# Altium schematic sheet pay_ssm.SchDoc
size A4
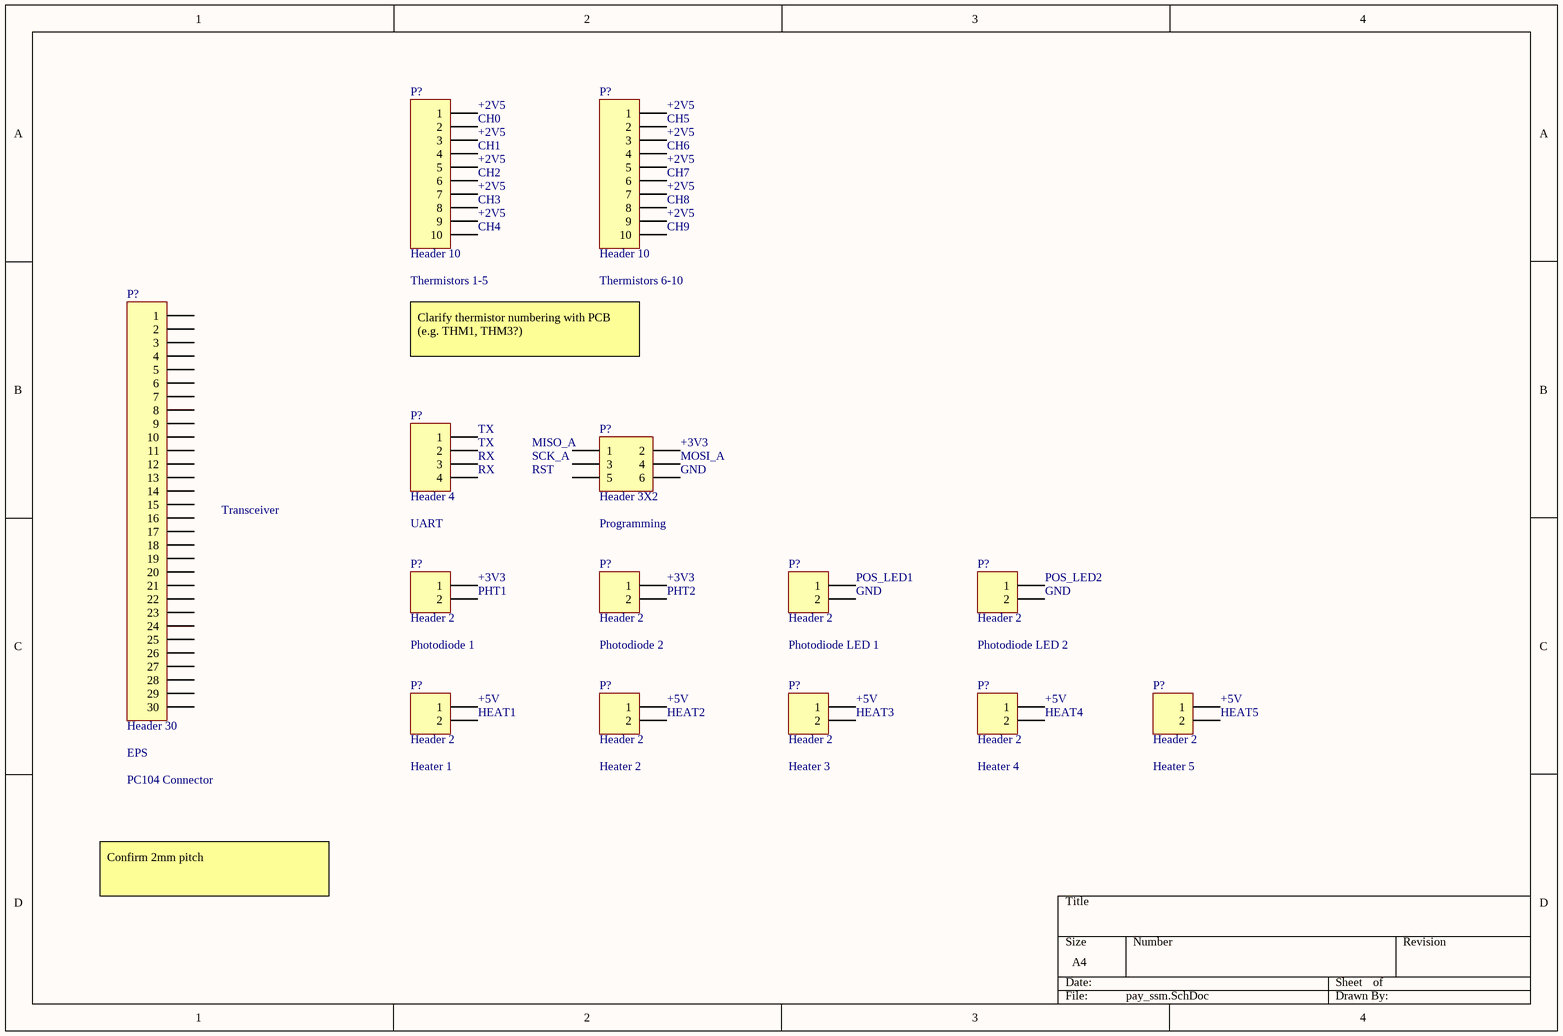
[diagram p0: pay_ssm.SchDoc]

## Parts
(Parts that share a designator on the sheet are numbered #1, #2 ... from top to bottom, then left to right.)
P?#1  Header 10  [HDR1X10]
P?#2  Header 10  [HDR1X10]
P?#3  Header 30  [HDR1X30]
P?#4  Header 4  [HDR1X4]
P?#5  Header 3X2  [HDR2X3]
P?#6  Header 2  [HDR1X2]
P?#7  Header 2  [HDR1X2]
P?#8  Header 2  [HDR1X2]
P?#9  Header 2  [HDR1X2]
P?#10  Header 2  [HDR1X2]
P?#11  Header 2  [HDR1X2]
P?#12  Header 2  [HDR1X2]
P?#13  Header 2  [HDR1X2]
P?#14  Header 2  [HDR1X2]

## Nets

Not connected (* = marked no-connect by the designer): P?#1 1 2 3 4 5 6 7 8 9 10; P?#2 1 2 3 4 5 6 7 8 9 10; P?#3 1 2 3 4 5 6 7 8 9 10 11 12 13 14 15 16 17 18 19 20 21 22 23 24 25 26 27 28 29 30; P?#4 1 2 3 4; P?#5 1 2 3 4 5 6; P?#6 1 2; P?#7 1 2; P?#8 1 2; P?#9 1 2; P?#10 1 2; P?#11 1 2; P?#12 1 2; P?#13 1 2; P?#14 1 2

## Notes on the sheet
- (near P?#1) +2V5
- (near P?#2) +2V5
- (near P?#1) CH0
- (near P?#1) CH1
- (near P?#1) CH2
- (near P?#2) CH5
- (near P?#2) CH6
- (near P?#2) CH7
- (near P?#1) CH3
- (near P?#1) CH4
- (near P?#2) CH8
- (near P?#2) CH9
- (near P?#1) Thermistors 1-5
- (near P?#2) Thermistors 6-10
- Clarify thermistor numbering with PCB (e.g. THM1, THM3?)
- (near P?#4) TX
- (near P?#5) MISO_A
- (near P?#5) +3V3
- Transceiver
- (near P?#4) RX
- (near P?#5) SCK_A
- (near P?#5) RST
- (near P?#5) MOSI_A
- (near P?#5) GND
- (near P?#4) UART
- (near P?#6) +3V3
- (near P?#5) Programming
- (near P?#7) +3V3
- (near P?#8) POS_LED1
- (near P?#9) POS_LED2
- (near P?#6) Photodiode 1
- (near P?#6) PHT1
- (near P?#7) Photodiode 2
- (near P?#7) PHT2
- (near P?#8) Photodiode LED 1
- (near P?#8) GND
- (near P?#9) Photodiode LED 2
- (near P?#9) GND
- (near P?#10) +5V
- (near P?#10) HEAT1
- (near P?#11) HEAT2
- (near P?#11) +5V
- (near P?#12) HEAT3
- (near P?#12) +5V
- (near P?#13) HEAT4
- (near P?#13) +5V
- (near P?#14) HEAT5
- (near P?#14) +5V
- (near P?#3) EPS
- PC104 Connector
- (near P?#10) Heater 1
- (near P?#11) Heater 2
- (near P?#12) Heater 3
- (near P?#13) Heater 4
- (near P?#14) Heater 5
- Confirm 2mm pitch

## Library data of the parts
P?#1 P?#2 = Header 10: Header, 10-Pin; LatestRevisionDate: 17-Jul-2002; LatestRevisionNote: Re-released for DXP Platform.; Publisher: Altium Limited
P?#3 = Header 30: Header, 30-Pin; LatestRevisionDate: 17-Jul-2002; LatestRevisionNote: Re-released for DXP Platform.; Publisher: Altium Limited
P?#4 = Header 4: Header, 4-Pin; LatestRevisionDate: 17-Jul-2002; LatestRevisionNote: Re-released for DXP Platform.; Publisher: Altium Limited
P?#5 = Header 3X2: Header, 3-Pin, Dual row; LatestRevisionDate: 17-Jul-2002; LatestRevisionNote: Re-released for DXP Platform.; Publisher: Altium Limited
P?#6-P?#14 = Header 2: Header, 2-Pin; LatestRevisionDate: 17-Jul-2002; LatestRevisionNote: Re-released for DXP Platform.; Publisher: Altium Limited